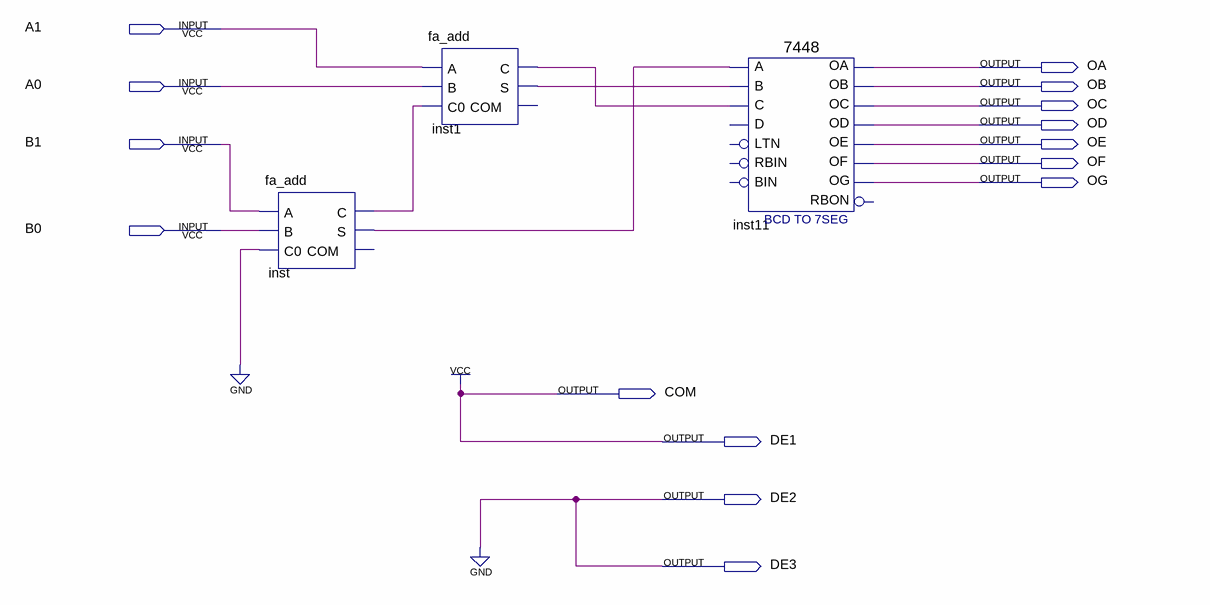
[diagram p0: schematic sheet]
// Quartus schematic add2.bdf as structural Verilog: 3 symbols, 15 pins
module add2 (
  input  A1,
  input  A0,
  input  B1,
  input  B0,
  output OA,
  output OB,
  output OC,
  output OD,
  output OE,
  output OF,
  output OG,
  output COM,
  output DE1,
  output DE2,
  output DE3
);

  wire inst1_c, inst1_s, inst_c, inst_s;

  fa_add inst (.A(B1), .B(B0), .C0(1'b0), .C(inst_c), .S(inst_s));  // open: COM
  fa_add inst1 (.A(A1), .B(A0), .C0(inst_c), .C(inst1_c), .S(inst1_s));  // open: COM
  \7448  inst11 (
    .A(inst_s), .C(inst1_c), .B(inst1_s), .OC(OC), .OE(OE), .OD(OD), .OF(OF), .OG(OG), .OB(OB), .OA(OA));  // open: D, RBIN, BIN, LTN, RBON

  assign COM = 1'b1;
  assign DE1 = 1'b1;
  assign DE2 = 1'b0;
  assign DE3 = 1'b0;
endmodule
